# Altium project 002_buck_converter.PrjPcb
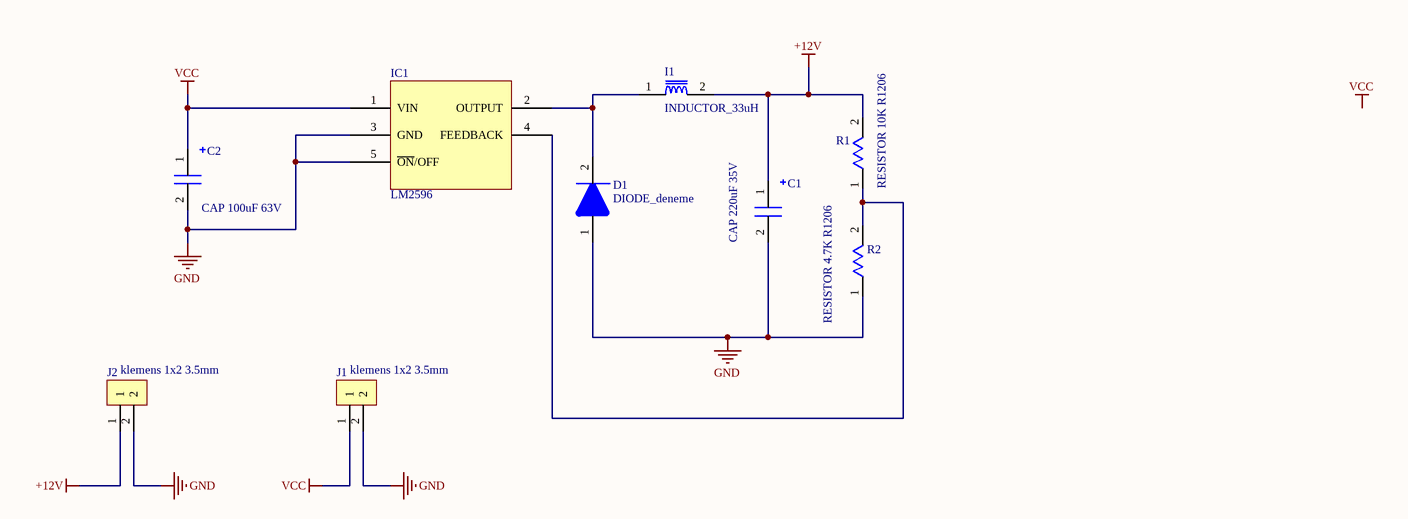
[diagram p0: LM2596_DC_TO_DC_schematic.SchDoc]
1 sheet, 9 parts. Net scope: global (net labels, ports and power ports of the same name join across sheets).
Board file: LM2596_DC_TO_DC_PCB1.PcbDoc

## Sheet LM2596_DC_TO_DC_schematic.SchDoc
size A4; SheetNumber: 1; SheetTotal: 1

### Parts
C1  CAP 220uF 35V  [CAPACITOR]
C2  CAP 100uF 63V  [CAPACITOR]
D1  DIODE_deneme  [DIODE_deneme]
I1  INDUCTOR_33uH  [SRR1280_Inductor]
IC1  LM2596  [D2PAK]
J1  klemens 1x2 3.5mm  [klemens 1x2 3.5mm]
J2  klemens 1x2 3.5mm  [klemens 1x2 3.5mm]
R1  RESISTOR 10K R1206  [R1206 RESISTER]
R2  RESISTOR 4.7K R1206  [R1206 RESISTER]

### Nets
+12V: C1.1 I1.2 J2.1 R1.2
GND: C1.2 C2.2 D1.1 IC1.3(GND) IC1.5(~{ON}/OFF) J1.2 J2.2 R2.1
VCC: C2.1 IC1.1(VIN) J1.1
NetD1_2: D1.2 I1.1 IC1.2(OUTPUT)
NetIC1_4: IC1.4(FEEDBACK) R1.1 R2.2

### Notes on the sheet
- Labels drawn without touching a wire or pin: VCC

### Library data of the parts
C2 = CAP 100uF 63V: CAPACITOR
D1 = DIODE_deneme: diode deneme yaptık kafamıza göre
I1 = INDUCTOR_33uH: INDUCTOR_33uH_SRR1280
IC1 = LM2596: REGULATOR  DC TO DC ,DUCK CONVERTER
R1 = RESISTOR 10K R1206: R1206 RESISTER
R2 = RESISTOR 4.7K R1206: R1206 RESISTER